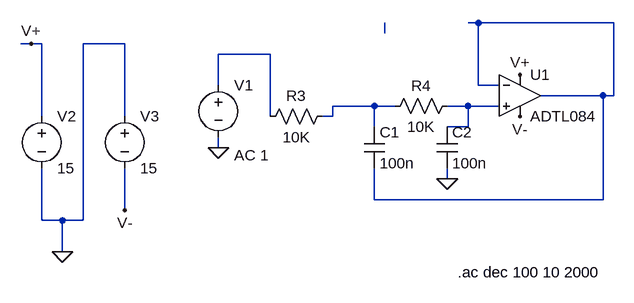
[diagram p0: schematic sallenkey.asc]
sallenkey.asc, the LTspice schematic file:
Version 4.1
SHEET 1 880 680
WIRE 80 32 64 32
WIRE 288 32 80 32
WIRE -64 48 -64 32
WIRE -608 64 -624 64
WIRE -592 64 -608 64
WIRE -464 64 -528 64
WIRE -240 80 -320 80
WIRE -320 128 -320 80
WIRE 80 128 80 32
WIRE 112 128 80 128
WIRE 272 144 176 144
WIRE 288 144 288 32
WIRE 288 144 272 144
WIRE -80 160 -144 160
WIRE -48 160 -80 160
WIRE 64 160 32 160
WIRE 112 160 64 160
WIRE -592 176 -592 64
WIRE -464 176 -464 64
WIRE -240 176 -240 80
WIRE -144 176 -144 160
WIRE -144 176 -160 176
WIRE -80 192 -80 160
WIRE 64 192 64 160
WIRE 64 192 32 192
WIRE -320 224 -320 208
WIRE 32 272 32 256
WIRE -80 304 -80 256
WIRE 272 304 272 144
WIRE 272 304 -80 304
WIRE -464 320 -464 256
WIRE -592 336 -592 256
WIRE -560 336 -592 336
WIRE -528 336 -528 64
WIRE -528 336 -560 336
WIRE -560 384 -560 336
FLAG 32 272 0
FLAG -320 224 0
FLAG -560 384 0
FLAG -608 64 V+
FLAG 144 112 V+
FLAG -464 320 V-
FLAG 144 176 V-
SYMBOL OpAmps\\ADTL084 144 80 R0
SYMATTR InstName U1
SYMBOL cap -96 192 R0
SYMATTR InstName C1
SYMATTR Value 100n
SYMBOL cap 16 192 R0
SYMATTR InstName C2
SYMATTR Value 100n
SYMBOL res -144 160 R90
WINDOW 0 0 56 VBottom 2
WINDOW 3 32 56 VTop 2
SYMATTR InstName R3
SYMATTR Value 10K
SYMBOL res 48 144 R90
WINDOW 0 0 56 VBottom 2
WINDOW 3 32 56 VTop 2
SYMATTR InstName R4
SYMATTR Value 10K
SYMBOL voltage -320 112 R0
WINDOW 123 24 124 Left 2
WINDOW 39 0 0 Left 0
SYMATTR InstName V1
SYMATTR Value ""
SYMATTR Value2 AC 1
SYMBOL voltage -592 160 R0
WINDOW 123 0 0 Left 0
WINDOW 39 0 0 Left 0
SYMATTR InstName V2
SYMATTR Value 15
SYMBOL voltage -464 160 R0
WINDOW 123 0 0 Left 0
WINDOW 39 0 0 Left 0
SYMATTR InstName V3
SYMATTR Value 15
TEXT 48 416 Left 2 !.ac dec 100 10 2000

The netlist it stands for:
* sallenkey.asc
X§U1 N005 N001 V+ V- N001 ADTL084  ; pins In+ In- V+ V- OUT
C1 N004 N001 100n
C2 N005 0 100n
R3 N004 N003 10K
R4 N005 N004 10K
V1 N003 0 AC 1
V2 V+ 0 15
V3 0 V- 15
.ac dec 100 10 2000
.lib ADTL084.lib
.backanno
.end